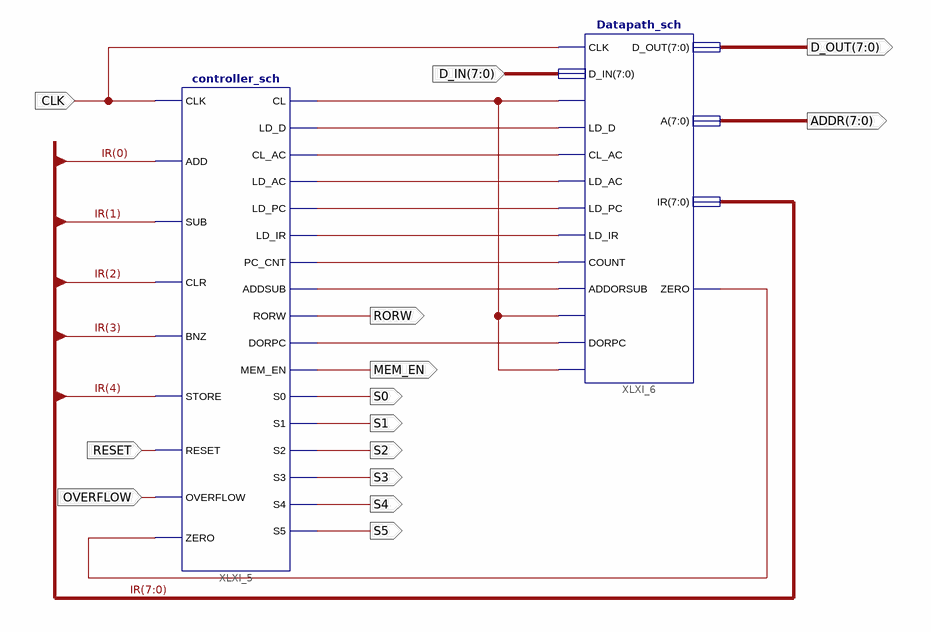
[diagram p0: schematic sheet 1]
// Xilinx ISE schematic toy_sch.sch (spartan3e) as structural Verilog: 2 symbols, 14 ports
module toy_sch (
  input  [7:0] D_IN,
  input  CLK,
  input  RESET,
  input  OVERFLOW,
  output RORW,
  output MEM_EN,
  output S0,
  output S1,
  output S2,
  output S3,
  output S4,
  output S5,
  output [7:0] D_OUT,
  output [7:0] ADDR
);

  wire XLXN_22, XLXN_23, XLXN_24, XLXN_26, XLXN_29, XLXN_53, XLXN_54, XLXN_55, XLXN_56, XLXN_59;
  wire [7:0] IR;

  controller_sch XLXI_5 (
    .CLK(CLK), .ADD(IR[0]), .ZERO(XLXN_59), .CLR(IR[2]), .RESET(RESET), .SUB(IR[1]), .BNZ(IR[3]),
    .STORE(IR[4]), .OVERFLOW(OVERFLOW), .S4(S4), .S0(S0), .S1(S1), .MEM_EN(MEM_EN), .PC_CNT(XLXN_54),
    .S2(S2), .LD_IR(XLXN_26), .CL_AC(XLXN_23), .CL(XLXN_56), .S3(S3), .LD_D(XLXN_22), .ADDSUB(XLXN_55),
    .LD_AC(XLXN_24), .LD_PC(XLXN_53), .DORPC(XLXN_29), .S5(S5), .RORW(RORW));
  Datapath_sch XLXI_6 (
    .CL_D(XLXN_56), .LD_D(XLXN_22), .CL_IR(XLXN_56), .CLK(CLK), .D_IN(D_IN), .LD_IR(XLXN_26),
    .CL_PC(XLXN_56), .COUNT(XLXN_54), .LD_PC(XLXN_53), .ADDORSUB(XLXN_55), .DORPC(XLXN_29), .CL_AC(XLXN_23),
    .LD_AC(XLXN_24), .A(ADDR), .IR(IR), .ZERO(XLXN_59), .D_OUT(D_OUT));
endmodule
